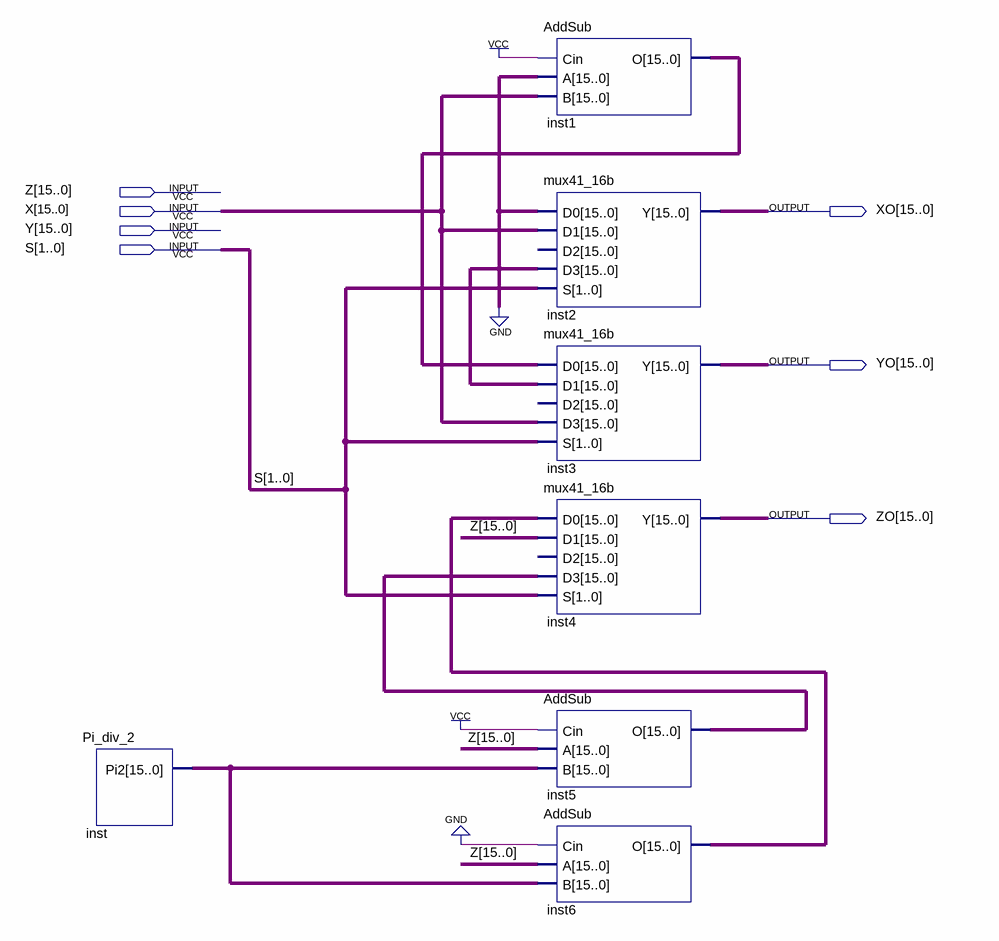
[diagram p0: schematic sheet]
// Quartus schematic XYZ_Processor.bdf as structural Verilog: 7 symbols, 7 pins
module XYZ_Processor (
  input  [15:0] Z,
  input  [15:0] X,
  input  [15:0] Y,
  input  [1:0] S,
  output [15:0] XO,
  output [15:0] YO,
  output [15:0] ZO
);

  wire [15:0] inst1_o, inst5_o, inst6_o, inst_pi2;

  Pi_div_2 inst (.Pi2(inst_pi2));
  AddSub inst1 (.Cin(1'b1), .A({16{1'b0}}), .B(X), .O(inst1_o));
  mux41_16b inst2 (.D0({16{1'b0}}), .D1(X), .D3({16{1'b0}}), .S(S), .Y(XO));  // open: D2
  mux41_16b inst3 (.D0(inst1_o), .D1({16{1'b0}}), .D3(X), .S(S), .Y(YO));  // open: D2
  mux41_16b inst4 (.D0(inst6_o), .D1(Z), .D3(inst5_o), .S(S), .Y(ZO));  // open: D2
  AddSub inst5 (.Cin(1'b1), .A(Z), .B(inst_pi2), .O(inst5_o));
  AddSub inst6 (.Cin(1'b0), .A(Z), .B(inst_pi2), .O(inst6_o));
endmodule
